# Altium schematic sheet DB10005_Software.SchDoc
size A3 portrait
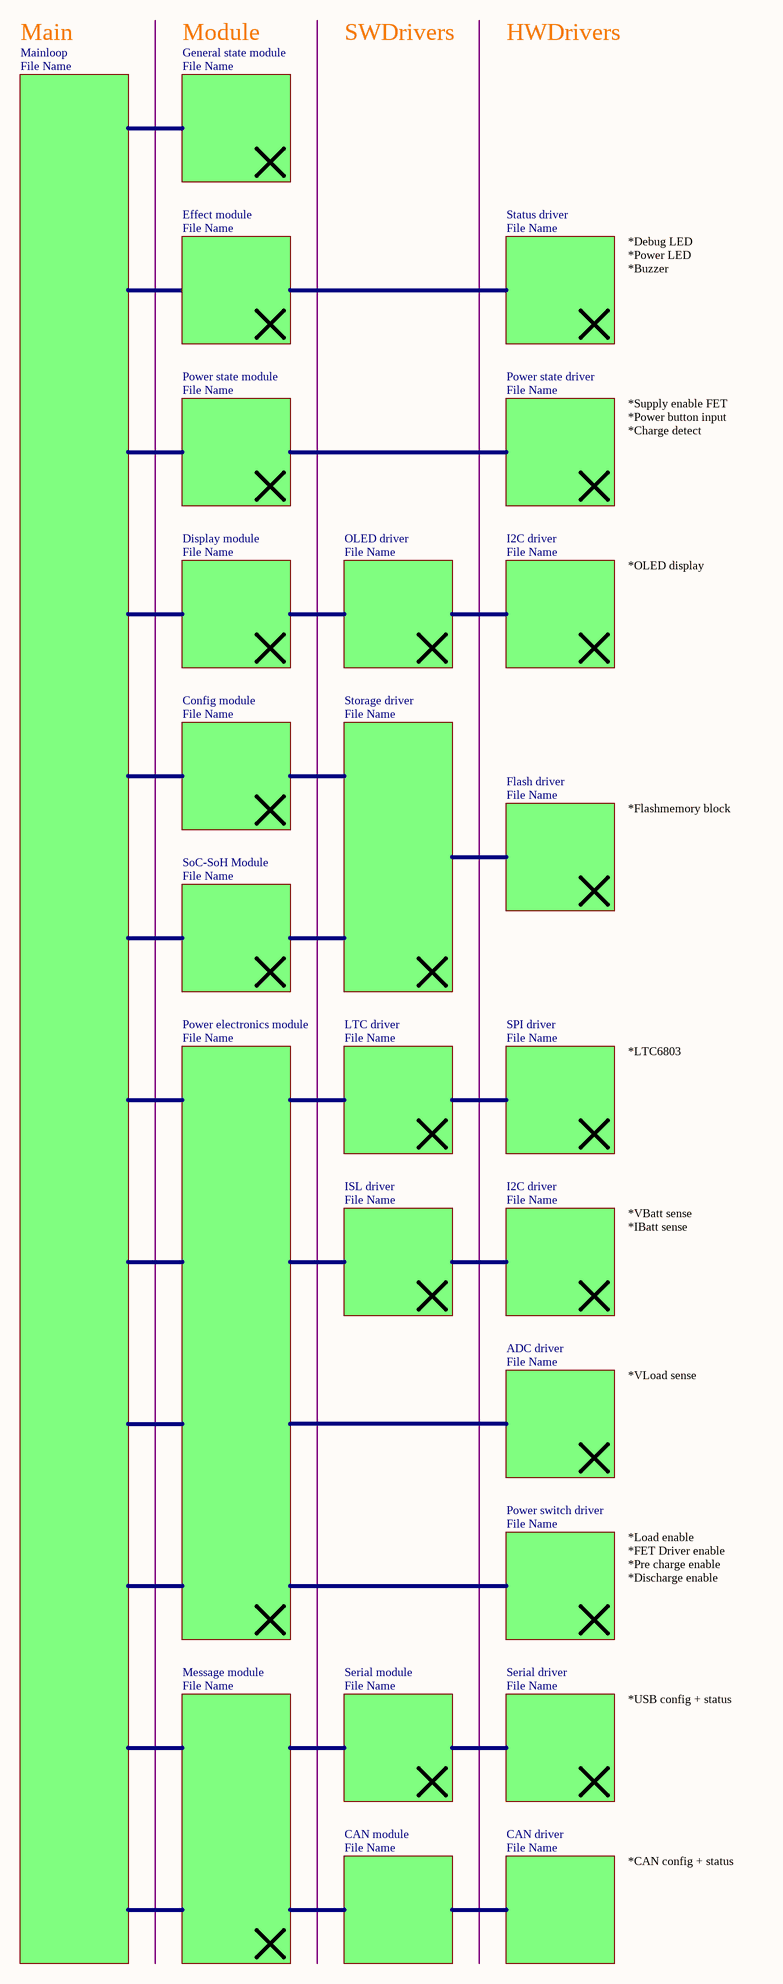
[diagram p0: DB10005_Software.SchDoc]

## Sub-sheets
ADC driver = File Name: no entries
CAN driver = File Name: no entries
CAN module = File Name: no entries
Config module = File Name: no entries
Display module = File Name: no entries
Effect module = File Name: no entries
Flash driver = File Name: no entries
General state module = File Name: no entries
I2C driver = File Name: no entries
I2C driver = File Name: no entries
ISL driver = File Name: no entries
LTC driver = File Name: no entries
Mainloop = File Name: no entries
Message module = File Name: no entries
OLED driver = File Name: no entries
Power electronics module = File Name: no entries
Power state driver = File Name: no entries
Power state module = File Name: no entries
Power switch driver = File Name: no entries
Serial driver = File Name: no entries
Serial module = File Name: no entries
SoC-SoH Module = File Name: no entries
SPI driver = File Name: no entries
Status driver = File Name: no entries
Storage driver = File Name: no entries

## Notes on the sheet
- Main
- Module
- SWDrivers
- HWDrivers
- *Debug LED
- *Power LED
- *Buzzer
- *Supply enable FET
- *Power button input
- *Charge detect
- *OLED display
- *Flashmemory block
- *LTC6803
- *VBatt sense
- *IBatt sense
- *VLoad sense
- *FET Driver enable
- *Pre charge enable
- *Load enable
- *Discharge enable
- *USB config + status
- *CAN config + status
- Title
- Size:
- Date:
- A3
- Number:
- Time:
- Revision:
- Sheet
- of
- File: